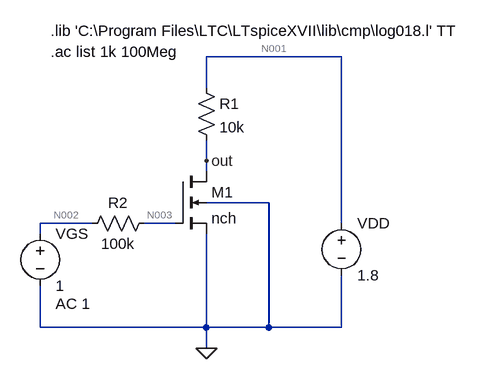
[diagram p0: schematic Week1_Ex2C.asc]
Week1_Ex2C.asc, the LTspice schematic file:
Version 4
SHEET 1 880 680
WIRE 416 160 208 160
WIRE 208 208 208 160
WIRE 208 320 208 288
WIRE 208 336 208 320
WIRE 304 384 208 384
WIRE 32 416 -48 416
WIRE 160 416 112 416
WIRE 416 416 416 160
WIRE -48 432 -48 416
WIRE -48 576 -48 512
WIRE 208 576 208 432
WIRE 208 576 -48 576
WIRE 304 576 304 384
WIRE 304 576 208 576
WIRE 416 576 416 496
WIRE 416 576 304 576
WIRE 208 608 208 576
FLAG 208 608 0
FLAG 208 320 out
SYMBOL nmos4 160 336 R0
SYMATTR InstName M1
SYMATTR Value nch
SYMATTR Value2 l=2u w=4u
SYMBOL voltage -48 416 R0
WINDOW 123 24 124 Left 2
WINDOW 39 0 0 Left 0
SYMATTR Value2 AC 1
SYMATTR InstName VGS
SYMATTR Value 1
SYMBOL voltage 416 400 R0
WINDOW 123 0 0 Left 0
WINDOW 39 0 0 Left 0
SYMATTR InstName VDD
SYMATTR Value 1.8
SYMBOL res 192 192 R0
SYMATTR InstName R1
SYMATTR Value 10k
SYMBOL res 128 400 R90
WINDOW 0 0 56 VBottom 2
WINDOW 3 32 56 VTop 2
SYMATTR InstName R2
SYMATTR Value 100k
TEXT -32 120 Left 2 !.lib 'C:\\Program Files\\LTC\\LTspiceXVII\\lib\\cmp\\log018.l' TT
TEXT -32 152 Left 2 !.ac list 1k 100Meg

The netlist it stands for:
* Week1_Ex2C.asc
M1 out N003 0 0 nch l=2u w=4u
VGS N002 0 1 AC 1
VDD N001 0 1.8
R1 N001 out 10k
R2 N003 N002 100k
.model NMOS NMOS
.model PMOS PMOS
.lib standard.mos
.lib 'C:\Program Files\LTC\LTspiceXVII\lib\cmp\log018.l' TT
.ac list 1k 100Meg
.backanno
.end

* Results of the author's LTspice run, read from the files saved beside the schematic
* Operating Point, zero values left out:
*   V(out) = 823.1 mV
*   V(n003) = 1 V
*   V(n002) = 1 V
*   V(n001) = 1.8 V
*   Id(M1) = 97.69 µA
*   Is(M1) = -97.69 µA
*   I(R1) = 97.69 µA
*   I(Vdd) = -97.69 µA
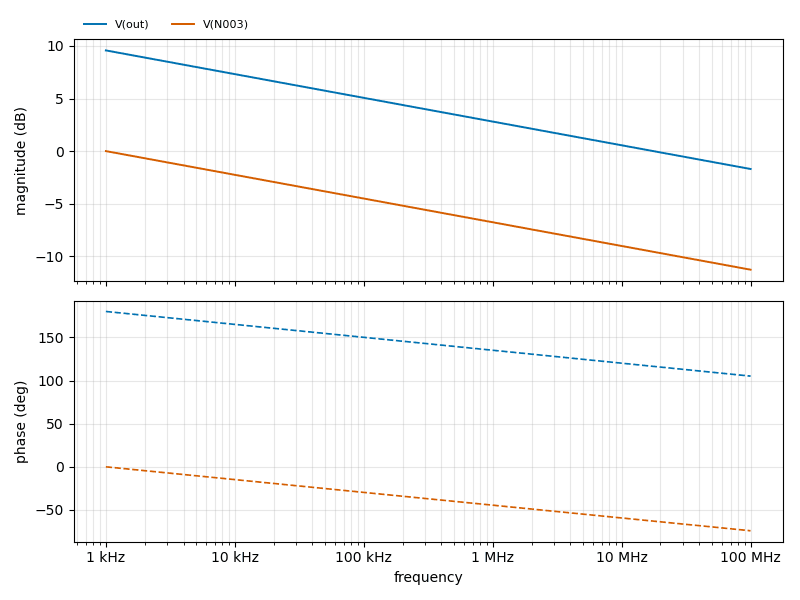
[diagram p1: AC Analysis of Week1_Ex2C.asc, plotted from the saved traces]
* AC Analysis, 1 run:
*   V(out): 9.58 dB at 1 kHz, -1.70 dB at 100 MHz, peak 9.58 dB at 1 kHz, 3 dB below the peak at 21.6 kHz
*   V(N003): -0.00 dB at 1 kHz, -11.28 dB at 100 MHz, peak -0.00 dB at 1 kHz, 3 dB below the peak at 21.6 kHz